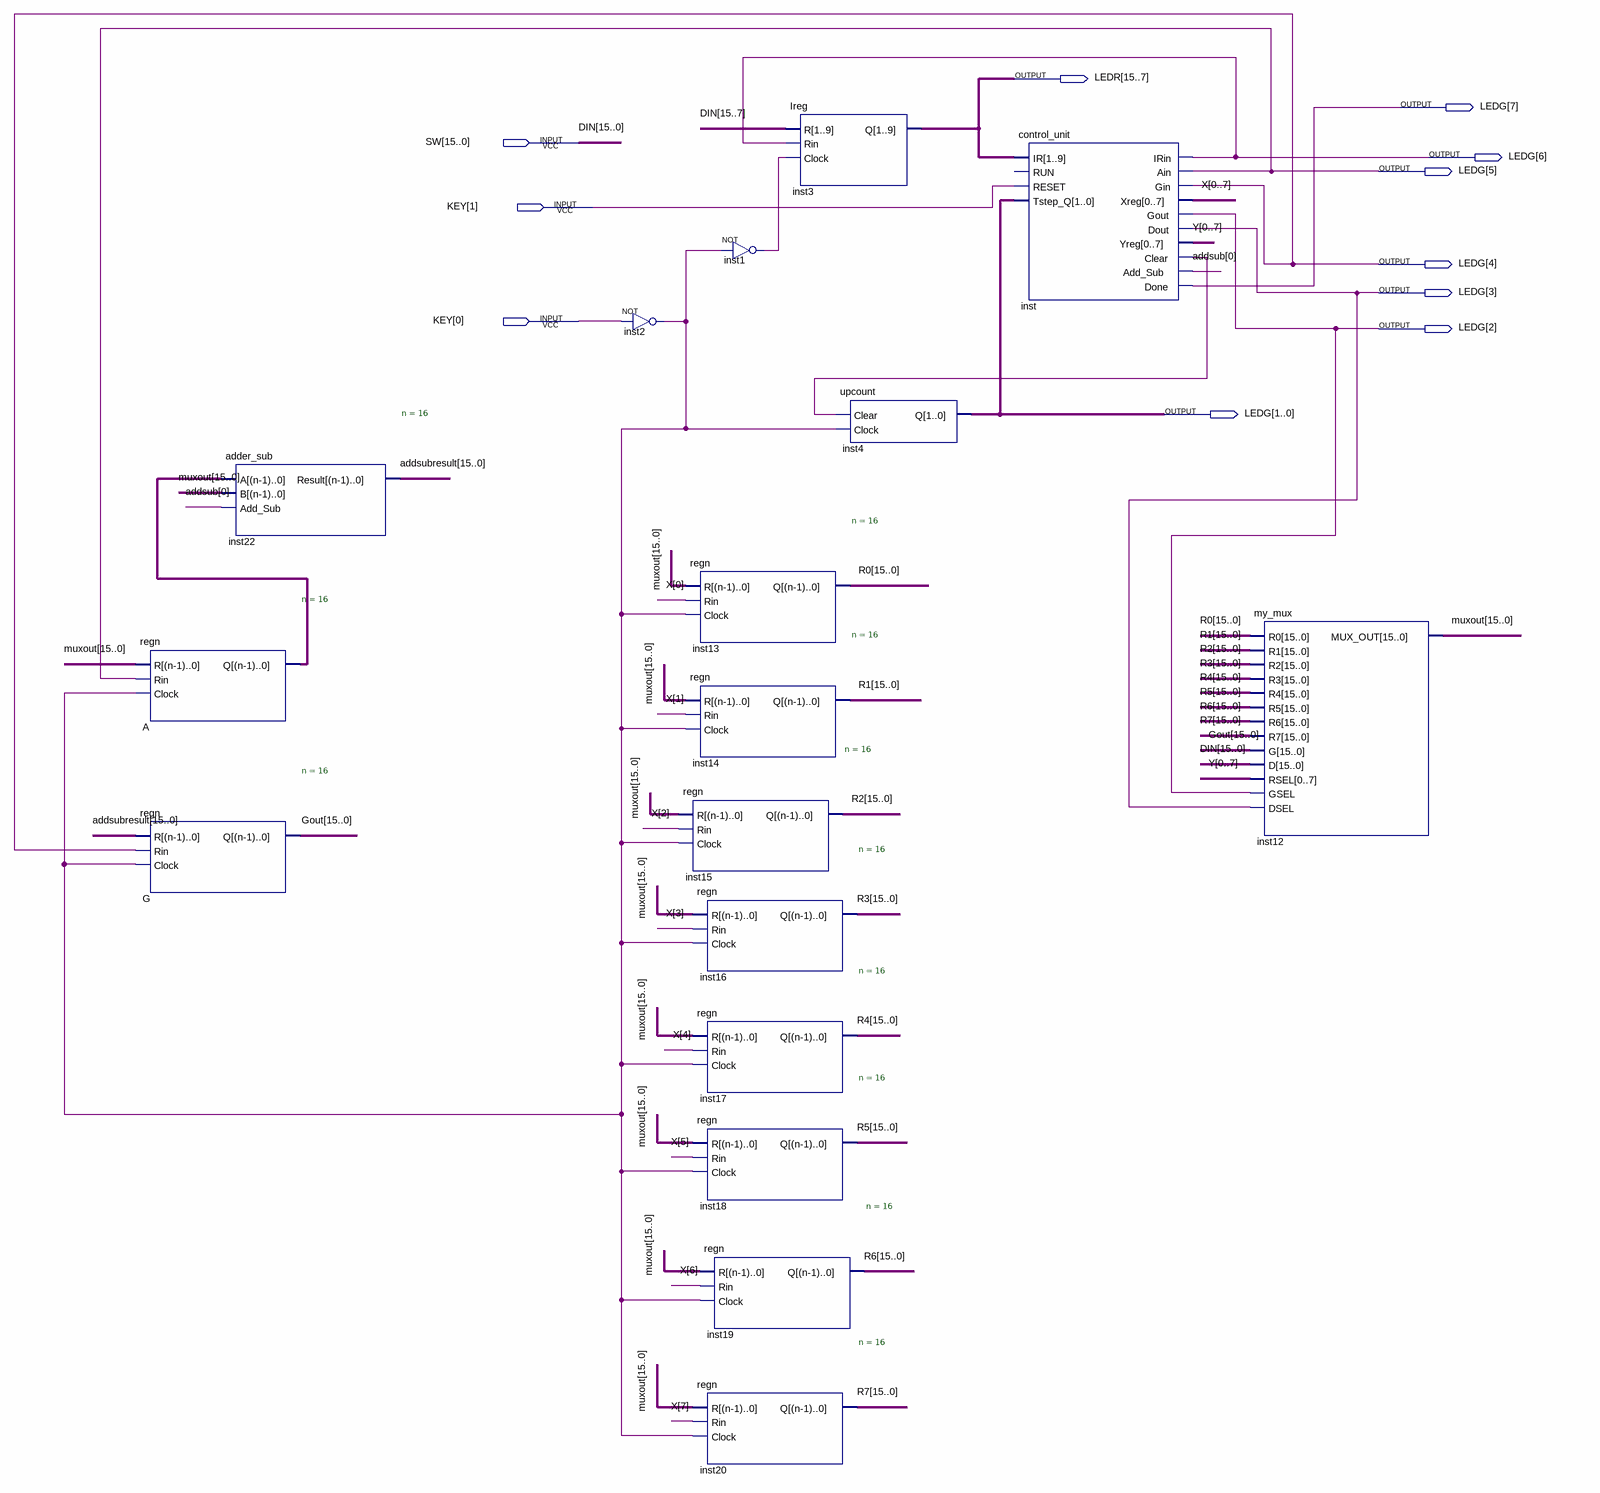
[diagram p0: schematic sheet]
// Quartus schematic CPU_TEST.bdf as structural Verilog: 17 symbols, 11 pins
module CPU_TEST (
  input  [15:0] SW,
  input  [1:0] KEY,
  output [15:7] LEDR,
  output [7:0] LEDG
);

  wire inst1_out, inst2_out, inst_clear;
  wire [0:0] addsub;
  wire [7:0] X, Y;
  wire [15:0] A_q, addsubresult, Gout, muxout, R0, R1, R2, R3, R4, R5, R6, R7;

  regn #(.n(16)) A (.R(muxout), .Rin(LEDG[5]), .Clock(inst2_out), .Q(A_q));
  regn #(.n(16)) G (.R(addsubresult), .Rin(LEDG[4]), .Clock(inst2_out), .Q(Gout));
  adder_sub #(.n(16)) inst22 (.A(A_q), .B(muxout), .Add_Sub(addsub[0]), .Result(addsubresult));
  not inst2 (inst2_out, KEY[0]);
  regn #(.n(16)) inst13 (.R(muxout), .Rin(X[0]), .Clock(inst2_out), .Q(R0));
  regn #(.n(16)) inst14 (.R(muxout), .Rin(X[1]), .Clock(inst2_out), .Q(R1));
  regn #(.n(16)) inst15 (.R(muxout), .Rin(X[2]), .Clock(inst2_out), .Q(R2));
  regn #(.n(16)) inst16 (.R(muxout), .Rin(X[3]), .Clock(inst2_out), .Q(R3));
  regn #(.n(16)) inst17 (.R(muxout), .Rin(X[4]), .Clock(inst2_out), .Q(R4));
  regn #(.n(16)) inst18 (.R(muxout), .Rin(X[5]), .Clock(inst2_out), .Q(R5));
  regn #(.n(16)) inst19 (.R(muxout), .Rin(X[6]), .Clock(inst2_out), .Q(R6));
  regn #(.n(16)) inst20 (.R(muxout), .Rin(X[7]), .Clock(inst2_out), .Q(R7));
  not inst1 (inst1_out, inst2_out);
  Ireg inst3 (.R(SW[15:7]), .Rin(LEDG[6]), .Clock(inst1_out), .Q(LEDR));
  upcount inst4 (.Clear(inst_clear), .Clock(inst2_out), .Q(LEDG[1:0]));
  control_unit inst (
    .IR(LEDR), .RESET(KEY[1]), .Tstep_Q(LEDG[1:0]), .IRin(LEDG[6]), .Ain(LEDG[5]), .Gin(LEDG[4]),
    .Xreg({X[0], X[1], X[2], X[3], X[4], X[5], X[6], X[7]}), .Gout(LEDG[2]), .Dout(LEDG[3]),
    .Yreg({Y[0], Y[1], Y[2], Y[3], Y[4], Y[5], Y[6], Y[7]}), .Clear(inst_clear), .Add_Sub(addsub[0]),
    .Done(LEDG[7]));  // open: RUN
  my_mux inst12 (
    .R0(R0), .R1(R1), .R2(R2), .R3(R3), .R4(R4), .R5(R5), .R6(R6), .R7(R7), .G(Gout), .D(SW),
    .RSEL({Y[0], Y[1], Y[2], Y[3], Y[4], Y[5], Y[6], Y[7]}), .GSEL(LEDG[2]), .DSEL(LEDG[3]), .MUX_OUT(muxout));

  // Other names for the same wires on the sheet: DIN[15:0] = SW
endmodule
